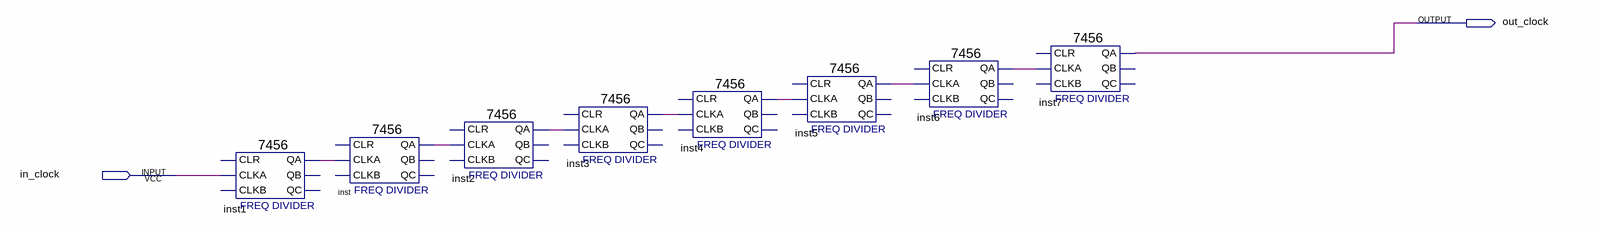
[diagram p0: schematic sheet]
// Quartus schematic freq_divider.bdf as structural Verilog: 8 symbols, 2 pins
module freq_divider (
  input  in_clock,
  output out_clock
);

  wire inst1_qa, inst2_qa, inst3_qa, inst4_qa, inst5_qa, inst6_qa, inst_qa;

  \7456  inst1 (.CLKA(in_clock), .QA(inst1_qa));  // open: CLKB, CLR, QC, QB
  \7456  inst (.CLKA(inst1_qa), .QA(inst_qa));  // open: CLKB, CLR, QC, QB
  \7456  inst2 (.CLKA(inst_qa), .QA(inst2_qa));  // open: CLKB, CLR, QC, QB
  \7456  inst3 (.CLKA(inst2_qa), .QA(inst3_qa));  // open: CLKB, CLR, QC, QB
  \7456  inst4 (.CLKA(inst3_qa), .QA(inst4_qa));  // open: CLKB, CLR, QC, QB
  \7456  inst5 (.CLKA(inst4_qa), .QA(inst5_qa));  // open: CLKB, CLR, QC, QB
  \7456  inst6 (.CLKA(inst5_qa), .QA(inst6_qa));  // open: CLKB, CLR, QC, QB
  \7456  inst7 (.CLKA(inst6_qa), .QA(out_clock));  // open: CLKB, CLR, QC, QB
endmodule
